# EAGLE design harvester_hat (EAGLE 9.0.1)
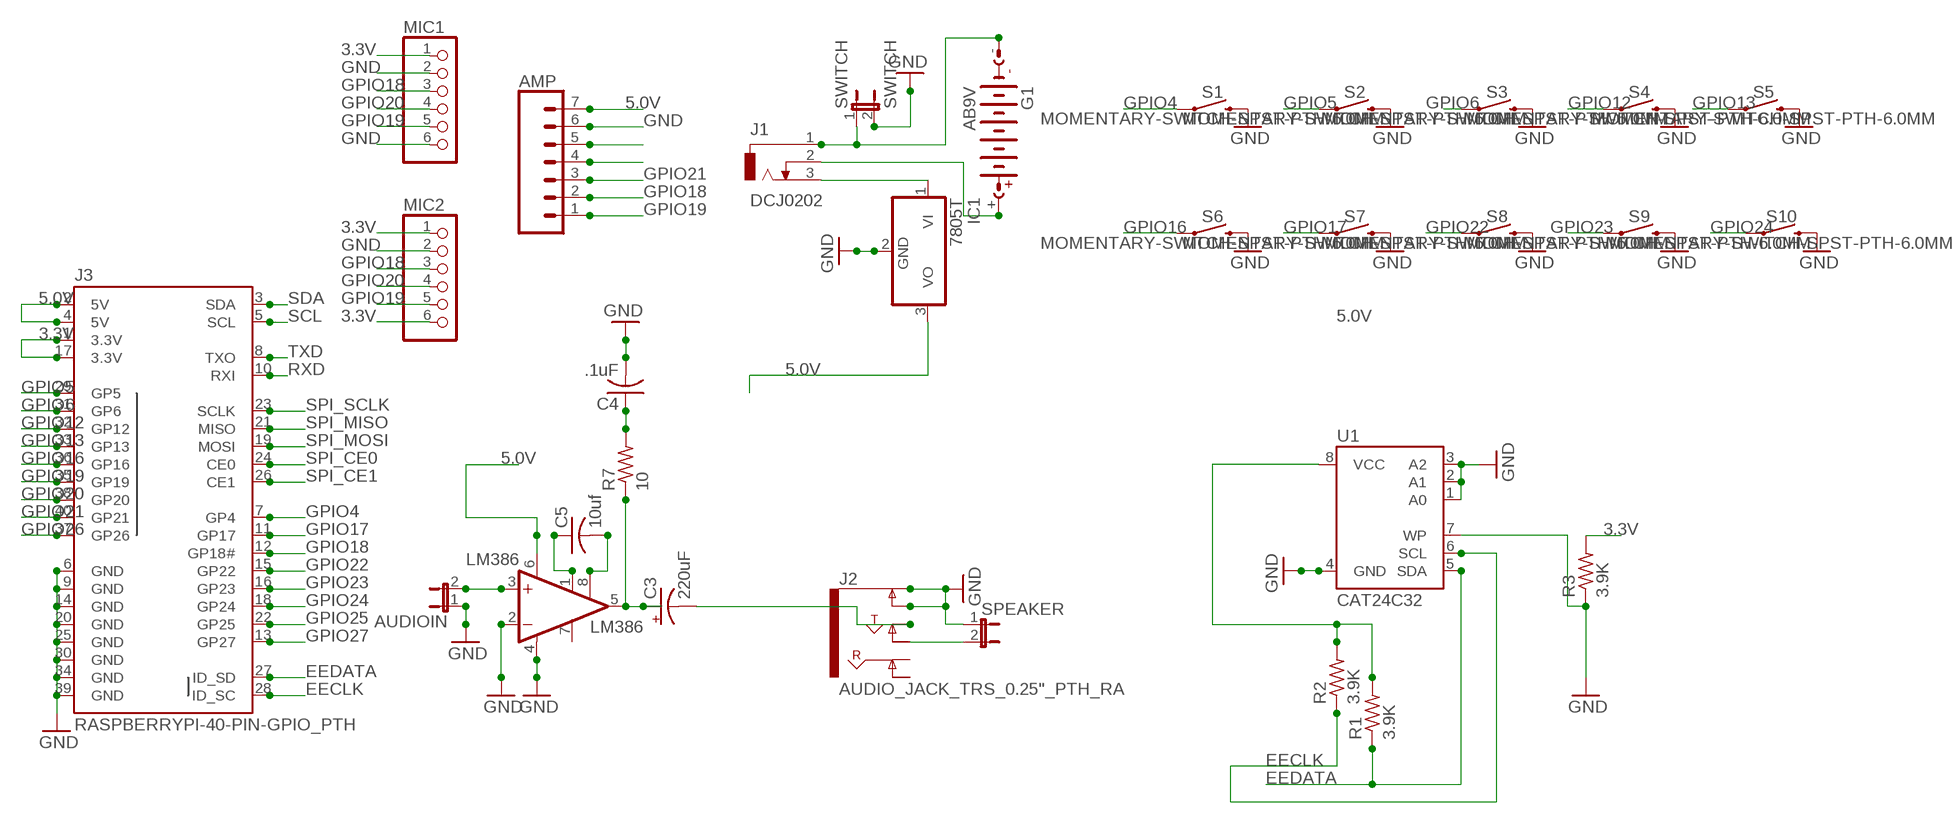
[diagram p0: schematic, sheet 1]

## Parts
AMP  CONN_07  [1X07]
AUDIOIN  JP1E  [JP1]
C3  220uF  CPOL-USE3.5-8  [E3,5-8]
C4  .1uF  C-US025-024X044  [C025-024X044]
C5  10uf  C-US025-024X044  [C025-024X044]
G1  AB9V  [AB9V]
IC1  7805T  [TO220H]
J1  DCJ0202  [DCJ0202]
J2  AUDIO_JACK_TRS_0.25"_PTH_RA  [AUDIO_JACK_0.25"_TRS_PTH_RA]
J3  RASPBERRYPI-40-PIN-GPIO_PTH  [2X20_SHROUDED]
LM386  LM386  LM386N-1  [DIL08]
MIC1  PINHD-1X6  [1X06]
MIC2  PINHD-1X6  [1X06]
R1  3.9K  R-US_0207/10  [0207/10]
R2  3.9K  R-US_0207/10  [0207/10]
R3  3.9K  R-US_0207/10  [0207/10]
R7  10  R-US_0204/7  [0204/7]
S1  MOMENTARY-SWITCH-SPST-PTH-6.0MM  [TACTILE_SWITCH_PTH_6.0MM]
S2  MOMENTARY-SWITCH-SPST-PTH-6.0MM  [TACTILE_SWITCH_PTH_6.0MM]
S3  MOMENTARY-SWITCH-SPST-PTH-6.0MM  [TACTILE_SWITCH_PTH_6.0MM]
S4  MOMENTARY-SWITCH-SPST-PTH-6.0MM  [TACTILE_SWITCH_PTH_6.0MM]
S5  MOMENTARY-SWITCH-SPST-PTH-6.0MM  [TACTILE_SWITCH_PTH_6.0MM]
S6  MOMENTARY-SWITCH-SPST-PTH-6.0MM  [TACTILE_SWITCH_PTH_6.0MM]
S7  MOMENTARY-SWITCH-SPST-PTH-6.0MM  [TACTILE_SWITCH_PTH_6.0MM]
S8  MOMENTARY-SWITCH-SPST-PTH-6.0MM  [TACTILE_SWITCH_PTH_6.0MM]
S9  MOMENTARY-SWITCH-SPST-PTH-6.0MM  [TACTILE_SWITCH_PTH_6.0MM]
S10  MOMENTARY-SWITCH-SPST-PTH-6.0MM  [TACTILE_SWITCH_PTH_6.0MM]
SPEAKER  JP1E  [JP1]
SWITCH  SWITCH  JP1E  [JP1]
U1  CAT24C32  AT24CP  [DIL08]

## Nets
3.3V: J3.1(3.3V) J3.17(3.3V) MIC1.1 MIC2.1 MIC2.6 R3.2
5.0V: AMP.7 IC1.3(VO) J3.2(5V) J3.4(5V) LM386.6(VS) R1.2 R2.2 U1.8(VCC)
EECLK: J3.28(ID_SC) R2.1 U1.6(SCL)
EEDATA: J3.27(ID_SD) R1.1 U1.5(SDA)
GND: AMP.6 AUDIOIN.1 C4.2 IC1.2(GND) J2.SLEEVE(EARTH) J2.SLEEVE-NORM(EARTH-NORM) J3.6(GND) J3.9(GND) J3.14(GND) J3.20(GND) J3.25(GND) J3.30(GND) J3.34(GND) J3.39(GND) LM386.2(-IN) LM386.4(GND) MIC1.2 MIC1.6 MIC2.2 R3.1 S1.3 S2.3 S3.3 S4.3 S5.3 S6.3 S7.3 S8.3 S9.3 S10.3 SPEAKER.1 SWITCH.2 U1.1(A0) U1.2(A1) U1.3(A2) U1.4(GND) U1.7(WP)
GPIO4: J3.7(GP4) S1.1
GPIO5: J3.29(GP5) S2.1
GPIO6: J3.31(GP6) S3.1
GPIO12: J3.32(GP12) S4.1
GPIO13: J3.33(GP13) S5.1
GPIO16: J3.36(GP16) S6.1
GPIO17: J3.11(GP17) S7.1
GPIO18: AMP.2 J3.12(GP18#) MIC1.3 MIC2.3
GPIO19: AMP.1 J3.35(GP19) MIC1.5 MIC2.5
GPIO20: J3.38(GP20) MIC1.4 MIC2.4
GPIO21: AMP.3 J3.40(GP21)
GPIO22: J3.15(GP22) S8.1
GPIO23: J3.16(GP23) S9.1
GPIO24: J3.18(GP24) S10.1
GPIO25: J3.22(GP25)
GPIO26: J3.37(GP26)
GPIO27: J3.13(GP27)
N$1: G1.+ J1.2
N$2: G1.- J1.1 SWITCH.1
N$3: IC1.1(VI) J1.3
N$4: AUDIOIN.2 LM386.3(+IN)
N$5: C5.1 LM386.1(GAIN)
N$6: J2.TIP-NORM SPEAKER.2
N$7: AMP.5
N$8: AMP.4
N$9: C3.- J2.TIP
N$10: C3.+ LM386.5(OUT) R7.1
N$13: C4.1 R7.2
N$14: C5.2 LM386.8(GAIN)
RXD: J3.10(RXI)
SCL: J3.5(SCL)
SDA: J3.3(SDA)
SPI_CE0: J3.24(CE0)
SPI_CE1: J3.26(CE1)
SPI_MISO: J3.21(MISO)
SPI_MOSI: J3.19(MOSI)
SPI_SCLK: J3.23(SCLK)
TXD: J3.8(TXO)
Unconnected: J2.RING J2.RING-NORM LM386.7(BYPASS)

## Library data of the parts
AMP = SparkFun-Connectors:CONN_07: Multi connection point. Often used as Generic Header-pin footprint for 0.1 inch spaced/style header connections On any of the 0.1 inch spaced packages, you can populate with these: Break Away Headers - Straight <https://www.sparkfun.com/products/116> (PRT-00116) Break Away Male Headers - Right Angle <https://www.sparkfun.com/products/553> (PRT-00553) Female Headers <https://www.sparkfun.com/products/115> (PRT-00115) Break Away Headers - Machine Pin <https://www.sparkfun.com/products/117> (PRT-00117) Break Away Female Headers - Swiss Machine Pin <https://www.sparkfun.com/products/743> (PRT-00743) For SCREWTERMINALS and SPRING TERMINALS visit here: Screw Terimnals on SparkFun.com <https://www.sparkfun.com/search/results?term=Screw+Terminals> (5mm/3.5mm/2.54mm spacing) This device is also useful as a general connection point to wire up your design to another part of your project. Our various solder wires solder well into these plated through hole pads. Hook-Up Wire - Assortment (Stranded, 22 AWG) <https://www.sparkfun.com/products/11375> (PRT-11375) Hook-Up Wire - Assortment (Solid Core, 22 AWG) <https://www.sparkfun.com/products/11367> (PRT-11367) View the entire wire category on our website here <https://www.sparkfun.com/categories/141> Special notes: Molex polarized connector foot print use with SKU : PRT-08231 with associated crimp pins and housings. 1MM SMD Version SKU: PRT-10208 NOTES ON THE VARIANTS LOCK and LOCK_LONGPADS... This footprint was designed to help hold the alignment of a through-hole component (i.e. 6-pin header) while soldering it into place. You may notice that each hole has been shifted either up or down by 0.005 of an inch from it's more standard position (which is a perfectly straight line). This slight alteration caused the pins (the squares in the middle) to touch the edges of the holes. Because they are alternating, it causes a "brace" to hold the component in place. 0.005 has proven to be the perfect amount of "off-center" position when using our standard breakaway headers. Although looks a little odd when you look at the bare footprint, once you have a header in there, the alteration is very hard to notice. Also,if you push a header all the way into place, it is covered up entirely on the bottom side.
AUDIOIN SPEAKER SWITCH = jumper:JP1E: JUMPER
C3 = rcl:CPOL-US: POLARIZED CAPACITOR, American symbol
C4 C5 = resistor:C-US: CAPACITOR, American symbol
G1 = battery:AB9V: 9-V BATTERY CLIP
IC1 = adafruit:78*: Positive VOLTAGE REGULATOR Added bigger pads to the TO-92 package
J1 = con-jack:DCJ0202: DC POWER JACK Source: DCJ0202.pdf; OC_FARNELL: unknown; OC_NEWARK: unknown
J2 = SparkFun-Connectors:AUDIO_JACK_TRS_0.25"_PTH_RA: Audio Jack, 1/4" TRS jack, horizontal, PTH, aka "Phono jack" Find the connector here: Audio Jack - 1/4" Stereo (right angle) <https://www.sparkfun.com/products/11144> (COM-11144) Datasheet <http://cdn.sparkfun.com/datasheets/Components/General/JP-611%20DD.jpg> Note, although the datasheet and physical part are slightly different, this footprint was proven to mate well on the Proto Pedal. This device is used on these SparkFun Products: SparkFun TRS Jack Breakout - 1/4" Stereo <https://www.sparkfun.com/products/13005> (BOB-13005 ) SparkFun Proto Pedal - sorry bad link - product comming soon! <https://www.sparkfun.com/products/13124> (PRT-13124); PROD_ID: CONN-12339; SF_ID: COM-11144
J3 = SparkFun-Connectors:RASPBERRYPI-40-PIN-GPIO: Raspberry Pi GPIO Header 2x20 pin connector, as found on B, B+, A+ models. Both shrouded PTH and SMT versions available. SparkFun Products: GPIO Shrouded Header <https://www.sparkfun.com/products/13054>- PTH SparkFun Pi Wedge (Preassembled) <https://www.sparkfun.com/products/13717>; PROD_ID: CONN-12263; SF_ID: PRT-13054
LM386 = linear:LM386?-*: Low Voltage Audio Power Amplifier Source: http://cache.national.com/ds/LM/LM386.pdf
MIC1 MIC2 = adafruit:PINHD-1X6: PIN HEADER
R1-R3 R7 = resistor:R-US_: RESISTOR, American symbol
S1-S10 = SparkFun-Switches:MOMENTARY-SWITCH-SPST: Momentary Switch (Pushbutton) - SPST Normally-open (NO) SPST momentary switches (buttons, pushbuttons). Variants PTH-12MM - 12mm square, through-hole Momentary Pushbutton Switch - 12mm Square <https://www.sparkfun.com/products/9190> (COM-09190) PTH-6.0MM, PTH-6.0MM-KIT - 6.0mm square, through-hole Mini Pushbutton Switch <https://www.sparkfun.com/products/97> (COM-00097) KIT package intended for soldering kit's - only one side of pads' copper is exposed. PTH-RIGHT-ANGLE-KIT - Right-angle, through-hole Right Angle Tactile Button <https://www.sparkfun.com/products/10791> - Used on SparkFun BigTime Watch Kit <https://www.sparkfun.com/products/11734> SMD-12MM - 12mm square, surface-mount Tactile Button - SMD (12mm) <https://www.sparkfun.com/products/12993> (COM-12993) Used on SparkFun PicoBoard <https://www.sparkfun.com/products/11888> SMD-4.5MM - 4.5mm Square Trackball Switch Used on SparkFun Blackberry Trackballer Breakout <https://www.sparkfun.com/products/13169> SMD-4.6MMX2.8MM - 4.60mm x 2.80mm, surface mount Used on SparkFun SAMD21 Mini Breakout <https://www.sparkfun.com/products/13664> SMD-5.2MM, SMD-5.2-REDUNDANT - 5.2mm square, surface-mount Mini Pushbutton Switch - SMD <https://www.sparkfun.com/products/8720> (COM-08720) Used on Arduino Pro Mini <https://www.sparkfun.com/products/11114> REDUNDANT package connects both switch circuits together SMD-6.0X3.5MM - 6.0 x 3.5mm, surface mount Momentary Reset Switch SMD <https://www.sparkfun.com/products/8229> (COM-08229) SMD-6.2MM-TALL - 6.2mm square, surface mount Tactile Button - SMD (6mm) <https://www.sparkfun.com/products/12992> Used on SparkFun Digital Sandbox <https://www.sparkfun.com/products/12651> SMD-RIGHT-ANGLE - Right-angle, surface mount Used on SparkFun Block for Intel® Edison - Arduino <https://www.sparkfun.com/products/13036>; PROD_ID: SWCH-08441; SF_SKU: COM-00097
U1 = atmel:AT24C*: 2-wire serial EEPROM; MPN: AT24C1024BW-SH-B; OC_FARNELL: 1362646; OC_NEWARK: 03P2044

## Board
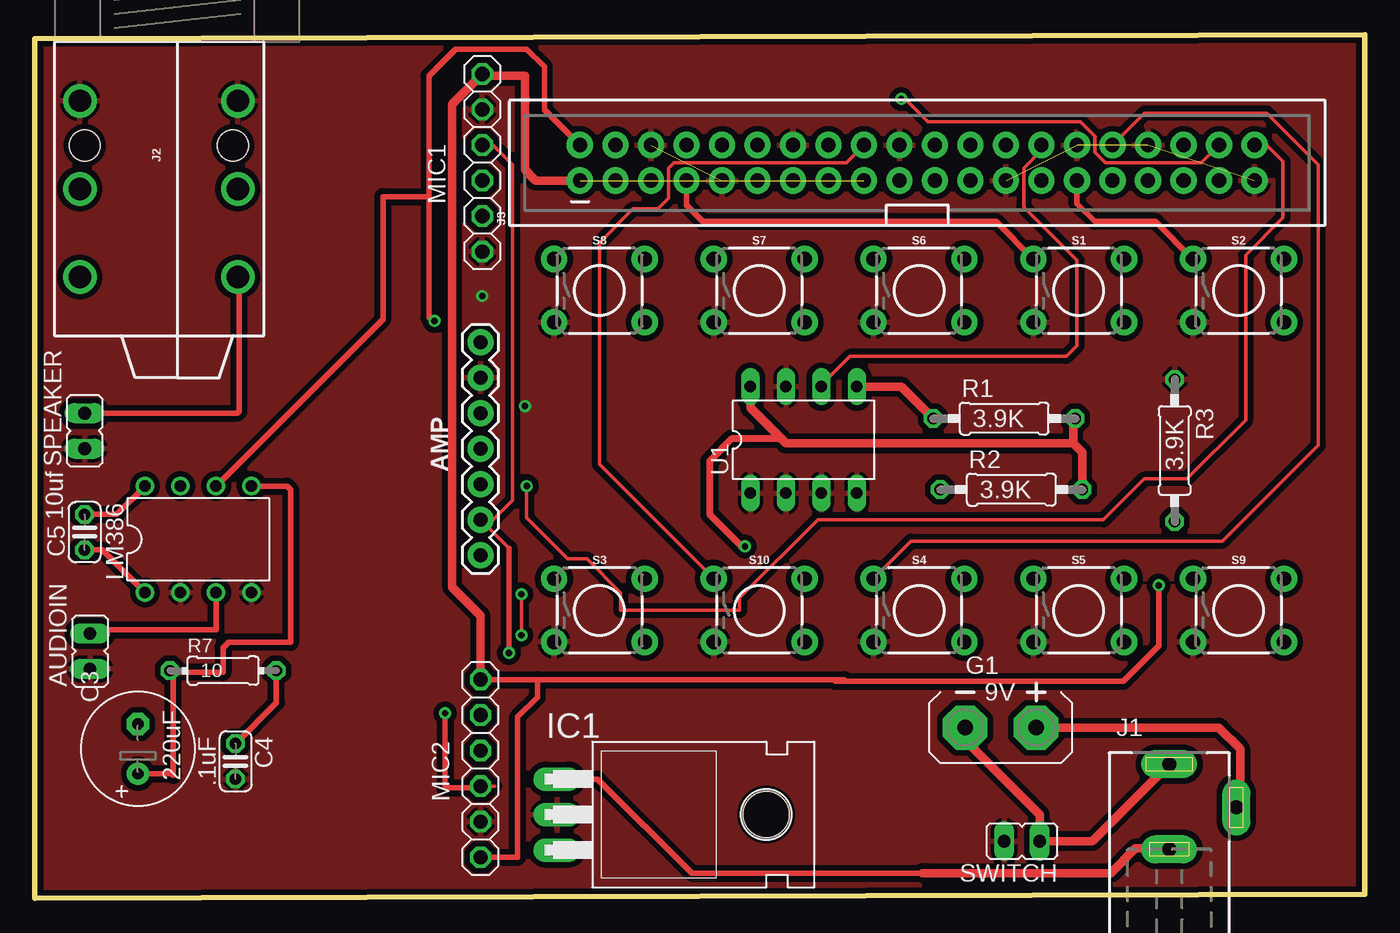
[diagram p1: board, top side]
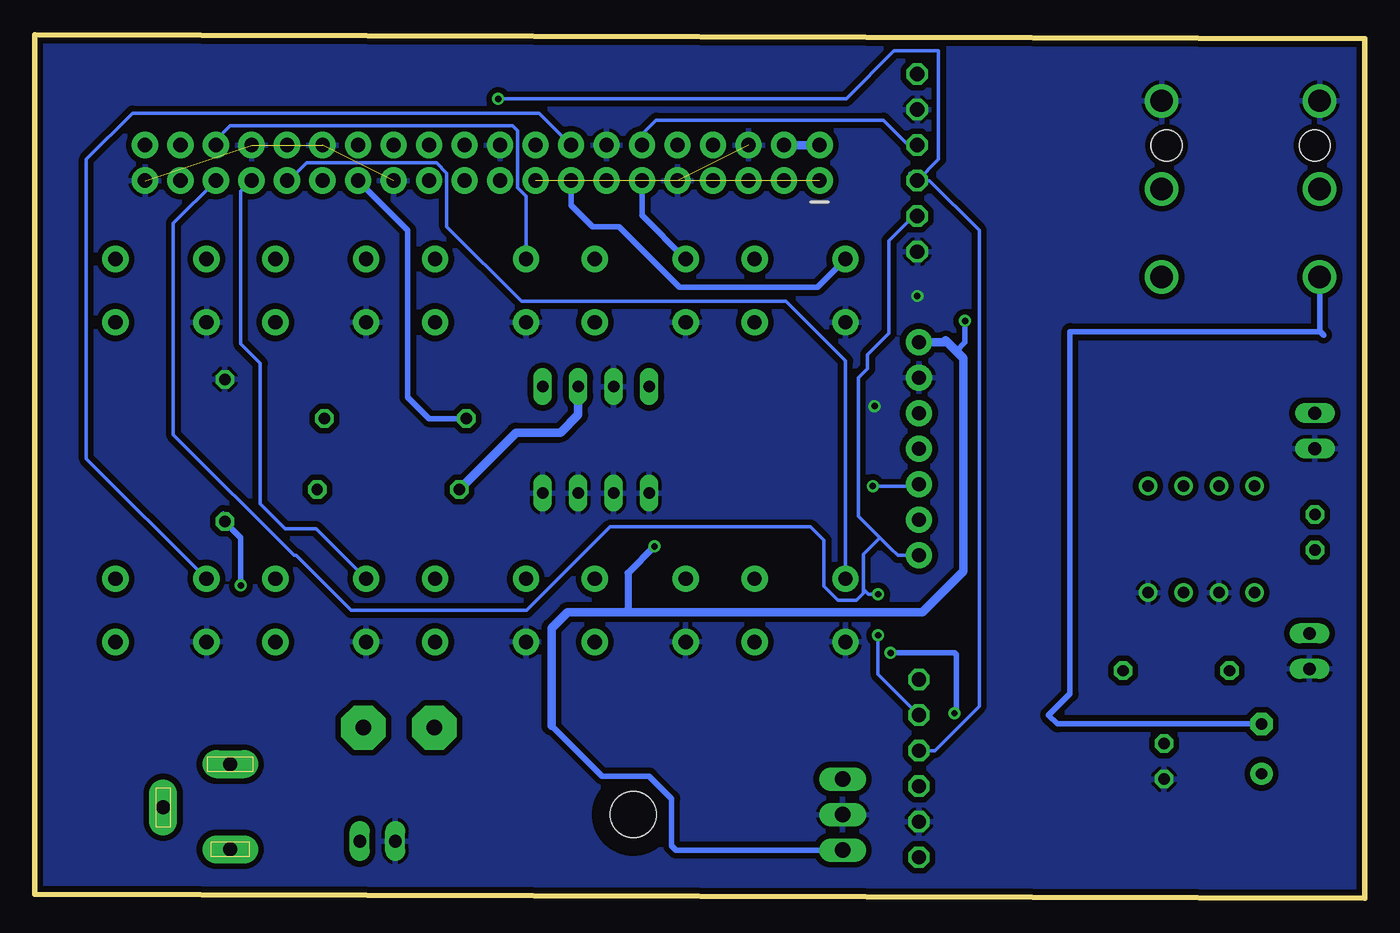
[diagram p2: board, bottom side, seen from below]

Size 95.12 x 61.72 mm. Coordinates in mm from the lower left corner, seen from the top.
Outline: 0,0 95.12,0.25 95.12,61.72 0,61.47 0,0
Copper layers (1*16): Top 0.035mm / dielectric 1.5mm / Bottom 0.035mm
Design rules "adafruit *": minimum track width 8mil, minimum drill 15.5mil, track to track 8mil, track to pad 8mil, pad to pad 8mil, via to via 8mil, smd to smd 8mil, copper to edge 10mil, drill to drill 8mil, minimum pad ring 10mil, minimum via ring 8mil, stop-mask expansion 2mil, vias tented up to drill 20mil, thermal gap 10mil

### Footprints (pad centres in the part's own frame; a part is rotated, then mirrored left to right if it is on the bottom)
1X07 = drill 1.016 pad 1.88: 1 0,0; 2 2.54,0; 3 5.08,0; 4 7.62,0; 5 10.16,0; 6 12.7,0; 7 15.24,0
JP1 = drill 0.914 long: 1 0,-1.27; 2 0,1.27
E3,5-8 = drill 0.813 pad 1.6: + -1.778,0 | drill 0.813 pad 1.6 octagon: - 1.778,0
C025-024X044 = drill 0.813 octagon: 1 -1.27,0; 2 1.27,0
AB9V = drill 1.118 pad 3.15 octagon: + 0,2.54; - 0,-2.54
TO220H = drill 1.118 long: 1 -2.54,-10.16; 2 0,-10.16; 3 2.54,-10.16 | hole 3.302: 0,4.826
DCJ0202 = drill 1 pad 2 long: 1 0,3.1; 2 4.8,0; 3 0,-3
AUDIO_JACK_0.25"_TRS_PTH_RA = drill 1.6: RING 10.5,-6.95; RING-NORM 10.5,4.35; SLEEVE 4.2,-6.95; SLEEVE-NORM 4.2,4.35; TIP 16.8,-6.95; TIP-NORM 16.8,4.35 | hole 2.2: 7.4,4; 7.4,-6.6
2X20_SHROUDED = drill 1.016 pad 1.88: 1 -1.27,24.13; 2 1.27,24.13; 3 -1.27,21.59; 4 1.27,21.59; 5 -1.27,19.05; 6 1.27,19.05; 7 -1.27,16.51; 8 1.27,16.51; 9 -1.27,13.97; 10 1.27,13.97; 11 -1.27,11.43; 12 1.27,11.43; 13 -1.27,8.89; 14 1.27,8.89; 15 -1.27,6.35; 16 1.27,6.35; 17 -1.27,3.81; 18 1.27,3.81; 19 -1.27,1.27; 20 1.27,1.27; 21 -1.27,-1.27; 22 1.27,-1.27; 23 -1.27,-3.81; 24 1.27,-3.81; 25 -1.27,-6.35; 26 1.27,-6.35; 27 -1.27,-8.89; 28 1.27,-8.89; 29 -1.27,-11.43; 30 1.27,-11.43; 31 -1.27,-13.97; 32 1.27,-13.97; 33 -1.27,-16.51; 34 1.27,-16.51; 35 -1.27,-19.05; 36 1.27,-19.05; 37 -1.27,-21.59; 38 1.27,-21.59; 39 -1.27,-24.13; 40 1.27,-24.13
DIL08 = drill 0.813 pad 1.27: 1 -3.81,-3.81; 2 -1.27,-3.81; 3 1.27,-3.81; 4 3.81,-3.81; 5 3.81,3.81; 6 1.27,3.81; 7 -1.27,3.81; 8 -3.81,3.81
1X06 = drill 1.016 octagon: 1 -6.35,0; 2 -3.81,0; 3 -1.27,0; 4 1.27,0; 5 3.81,0; 6 6.35,0
0207/10 = drill 0.813 octagon: 1 -5.08,0; 2 5.08,0
0204/7 = drill 0.813 octagon: 1 -3.81,0; 2 3.81,0
TACTILE_SWITCH_PTH_6.0MM = drill 1.016 pad 1.88: 1 -3.251,2.261; 2 3.251,2.261; 3 -3.251,-2.261; 4 3.251,-2.261
DIL08' = drill 0.813 long: 1 -3.81,-3.81; 2 -1.27,-3.81; 3 1.27,-3.81; 4 3.81,-3.81; 5 3.81,3.81; 6 1.27,3.81; 7 -1.27,3.81; 8 -3.81,3.81

### Placement (x,y rotation side)
AMP  31.88,24.51 90 top
AUDIOIN  3.94,17.65 0 top
C3  7.37,10.67 90 top
C4  14.35,9.78 270 top
C5  3.56,26.16 90 top
G1  69.09,12.19 270 top
IC1  47.5,5.97 270 top
J1  81.15,6.48 0 top
J2  10.16,61.21 270 top
J3  63.12,52.58 90 top
LM386  11.68,25.65 0 top
MIC1  32,52.58 270 top
MIC2  31.88,9.27 90 top
R1  69.34,34.29 0 top
R2  69.85,29.21 0 top
R3  81.53,32 270 top
R7  13.46,16.26 0 top
S1  74.68,43.43 0 top
S2  86.11,43.43 0 top
S3  40.39,20.57 0 top
S4  63.25,20.57 0 top
S5  74.68,20.57 0 top
S6  63.25,43.43 0 top
S7  51.82,43.43 0 top
S8  40.39,43.43 0 top
S9  86.11,20.57 0 top
S10  51.82,20.57 0 top
SPEAKER  3.56,33.4 0 top
SWITCH  70.61,4.06 90 top
U1  CAT24C32  [DIL08']  54.99,32.77 0 top

### Tracks (layer width: path | path; a pad name or v marks a point on that pad's centre or on a via)
3.3V  (via drill 0.45)  (1 unrouted)
  Top 0.254: MIC2.1 31.24,2.92 | 57.15,15.62 57.28,15.49
  Top 0.406: 57.28,15.49 58.04,15.49 | 58.04,15.49 77.85,15.49 80.39,18.03 v80.39,22.35 | MIC2.6 35.94,15.62 | 35.94,15.62 57.91,15.62 58.04,15.49 | MIC2.1 34.54,2.92 34.54,12.95 35.94,14.35 35.94,15.62
  Top 0.61: MIC2.6 31.88,20.19 29.84,22.23 29.84,56.77 MIC1.1 32.13,58.8 35.05,58.8 35.05,52.07 35.81,51.31 J3.1
  Bottom 0.254: 81.66,27.56 81.53,27.43 R3.2
  Bottom 0.406: v80.39,22.35 80.39,25.78 R3.2
5.0V  (via drill 0.45)
  Top 0.406: J3.2 36.45,56.39 36.45,59.44 35.18,60.71 30.1,60.71 28.19,58.8 28.19,50.16 | v28.57,41.27 28.57,41.15 28.19,41.53 28.19,50.16 | LM386.6 24.89,41.4 24.89,50.16 28.19,50.16
  Top 0.508: 53.4,32.83 49.85,32.83 48.26,31.24 48.26,27.43 50.55,25.15 v50.8,25.15
  Top 0.61: U1.8 51.18,35.05 53.4,32.83 53.72,32.51 74.3,32.51 | 74.3,32.51 74.3,34.16 R1.2 | R2.2 74.93,31.88 74.3,32.51
  Bottom 0.254: U1.8 51.31,36.7 51.69,36.7
  Bottom 0.406: v28.57,41.27 28.57,39.75 29.21,39.12 | IC1.3 49.28,3.43 49.58,3.73 49.58,7.11 51.19,8.71 54.56,8.71 58.17,12.32
  Bottom 0.508: v50.8,25.15 52.7,23.24 52.7,20.7 52.45,20.45
  Bottom 0.61: 38.48,54.23 38.61,54.23 J3.2 J3.4 | AMP.7 30.1,39.75 29.97,39.88 29.21,39.12 28.7,38.61 28.7,23.37 31.62,20.45 52.45,20.45 57.02,20.45 58.17,19.3 58.17,12.32
EECLK
  Top 0.254: J3.28 72.01,53.47 70.74,52.2 70.74,49.4 74.55,45.59 74.55,39.5 73.79,38.73 58.29,38.73 56.26,36.7 U1.6
  Bottom 0.61: R2.1 60.71,33.27 57.53,33.27 56.26,34.54 U1.6
EEDATA
  Top 0.61: R1.1 61.98,36.58 U1.5
  Bottom 0.406: J3.27 68.45,47.75 68.45,35.81 66.93,34.29 R1.1
GND  (via drill 0.45)  (4 unrouted)
  Top 0.254: 32.13,4.95 32.13,5.21 MIC2.2 31.88,5.21 32.13,4.95 | 32.13,4.83 32.13,4.95
  other vias: 32,43.05 35.05,35.18
  pour Top (isolate 0.406): 0.13,0.38 0.13,61.72 95.12,61.72 95.38,61.98 95.38,0.51 95.63,0.25 18.8,0.25 18.67,0.13
  pour Bottom (isolate 0.406): -0.13,0.25 -0.13,61.59 18.54,61.72 95.12,61.72 95.38,61.98 95.38,0.38 95.63,0.13 18.67,0.13
GPIO4
  Top 0.406: J3.7 46.61,49.53 47.75,48.39 68.73,48.39 S1.1
GPIO5
  Top 0.406: S2.1 80.16,48.39 75.82,48.39 74.55,49.66 J3.29
GPIO6
  Bottom 0.254: S3.1 37.13,38.41 41.4,42.67 60.32,42.67 65.66,48.01 65.66,51.83 66.4,52.58 75.69,52.58 76.96,51.31 J3.31
GPIO12
  Top 0.254: S4.1 62.69,25.53 84.96,25.53 91.82,32.38 91.82,52.45 88.14,56.13 79.38,56.13 J3.32
GPIO13
  Top 0.254: 70.87,22.99 71.02,22.84 S5.1
  Bottom 0.254: 80.14,51.56 79.88,51.31 J3.33 80.39,50.55 80.39,39.62 78.99,38.23 78.99,28.19 77.22,26.42 75.01,26.42 S5.1
GPIO16
  Bottom 0.254: S6.1 59.99,50.2 60.58,50.78 60.58,54.86 60.96,55.24 81.15,55.24 82.17,54.23 J3.36
GPIO17
  Bottom 0.406: J3.11 51.69,48.82 S7.1
GPIO18  (via drill 0.45)
  Top 0.254: MIC1.3 32.77,53.85 34.16,52.45 34.16,28.45 32.77,27.05 AMP.2 33.91,25.02 | 32.89,8 MIC2.3
  Top 0.406: 33.91,25.02 v33.91,17.53 33.91,17.4 | v29.34,13.21 29.34,7.87 31.75,7.87 MIC2.3
  Bottom 0.254: J3.12 51.69,54.61 50.67,55.63 34.42,55.63 32.64,53.85 MIC1.3
  Bottom 0.406: v33.91,17.53 29.34,17.53 29.21,17.4 29.21,13.08 v29.34,13.21
GPIO19  (via drill 0.45)
  Top 0.254: AMP.1 32.26,24.13 32.38,24.13 | v34.8,18.8 v34.8,21.72
  Bottom 0.254: 32.51,24.51 AMP.1 33.4,24.51 33.91,25.02 34.67,25.78 | 34.67,25.78 36.2,27.3 36.2,37.21 35.56,37.85 35.56,38.86 34.04,40.39 34.04,46.99 32.26,48.77 MIC1.5 | J3.35 85.22,48.26 85.22,33.15 76.58,24.51 76.45,24.51 72.52,20.57 59.94,20.57 53.97,26.54 39.62,26.54 38.66,25.58 38.66,22.31 37.66,21.31 36.35,21.31 35.86,21.8 35.86,22.1 | 34.67,25.78 35.86,24.59 35.86,22.1 | MIC2.5 34.8,16 v34.8,18.8 | v34.8,21.72 35.48,21.72 35.86,22.1
GPIO20  (via drill 0.45)
  Top 0.254: 32.38,10.54 32.51,10.41 | J3.38 83.44,52.58 76.56,52.58 75.82,53.32 75.82,54.37 75.87,54.43 74.8,55.5 63.88,55.5 62.23,57.15 v61.98,57.15
  Top 0.406: MIC2.4 32.38,10.54
  Bottom 0.254: MIC1.4 32.51,51.82 | 31.5,10.16 MIC2.4 30.73,10.54 27.56,13.72 27.56,47.75 31.12,51.31 MIC1.4 | v61.98,57.15 37.08,57.15 33.66,60.58 30.48,60.58 30.48,52.83 MIC1.4
GPIO21  (via drill 0.45)
  Top 0.254: J3.40 88.14,53.85 89.28,52.7 89.28,48.64 86.61,45.97 86.61,34.16 82.42,29.97 79.38,29.97 76.45,27.05 56.01,27.05 50.42,21.46 50.42,20.57 41.91,20.57 41.91,21.84 39.5,24.26 38.1,24.26 35.18,27.18 v35.18,29.46
  Bottom 0.254: v35.18,29.46 32,29.46 AMP.3
GPIO22
  Bottom 0.406: J3.15 56.77,49.53 55.24,48.01 53.34,48.01 49.02,43.69 39.14,43.69 S8.1
GPIO23
  Bottom 0.254: S9.1 91.44,31.42 91.44,52.83 88.14,56.13 59.05,56.13 J3.16
GPIO24
  Top 0.254: S10.1 40.39,31.01 40.39,46.86 42.8,49.28 44.58,49.28 45.34,50.04 45.34,52.2 45.72,52.58 58.04,52.58 J3.18
N$1
  Top 0.61: G1.+ 84.71,12.19 86.23,10.67 86.23,6.76 J1.2
N$2
  Top 0.61: G1.- 66.55,11.3 71.88,5.97 SWITCH.1 75.64,4.06 J1.1
N$3
  Top 0.406: IC1.1 40.26,8.51 46.99,1.78 63.88,1.78
  Top 0.61: 63.5,1.78 63.88,1.78 76.96,1.78 78.74,3.56 81.07,3.56 J1.3
N$4
  Top 0.406: AUDIOIN.2 4.19,19.18 12.95,19.18 LM386.3
N$5
  Top 0.406: C5.1 4.83,24.89 LM386.1
N$6
  Top 0.406: SPEAKER.2 14.48,34.67 14.61,34.8 14.61,43.94 J2.TIP-NORM
N$9
  Bottom 0.406: C3.- 21.97,12.45 22.61,13.08 21.08,14.61 21.08,40.51 3.17,40.51 | 3.17,40.51 2.92,40.26 | 3.17,40.51 3.21,40.55 J2.TIP
N$10
  Top 0.406: C3.+ 9.78,8.89 9.91,8.76 9.91,16 R7.1 9.78,16.13 13.46,16.13 13.46,17.91 13.84,18.29 18.29,18.29 18.29,29.21 18.03,29.46 LM386.5
N$13
  Top 0.406: C4.1 17.27,13.97 R7.2
N$14
  Top 0.406: C5.2 5.84,27.43 LM386.8
SCL
  Bottom 0.406: 44.83,51.31 J3.5

### Text on the board
tSilk: + | + | + | +